# EAGLE schematic 3D_PRINTER_SHILED_V1 (EAGLE 6.5.0)
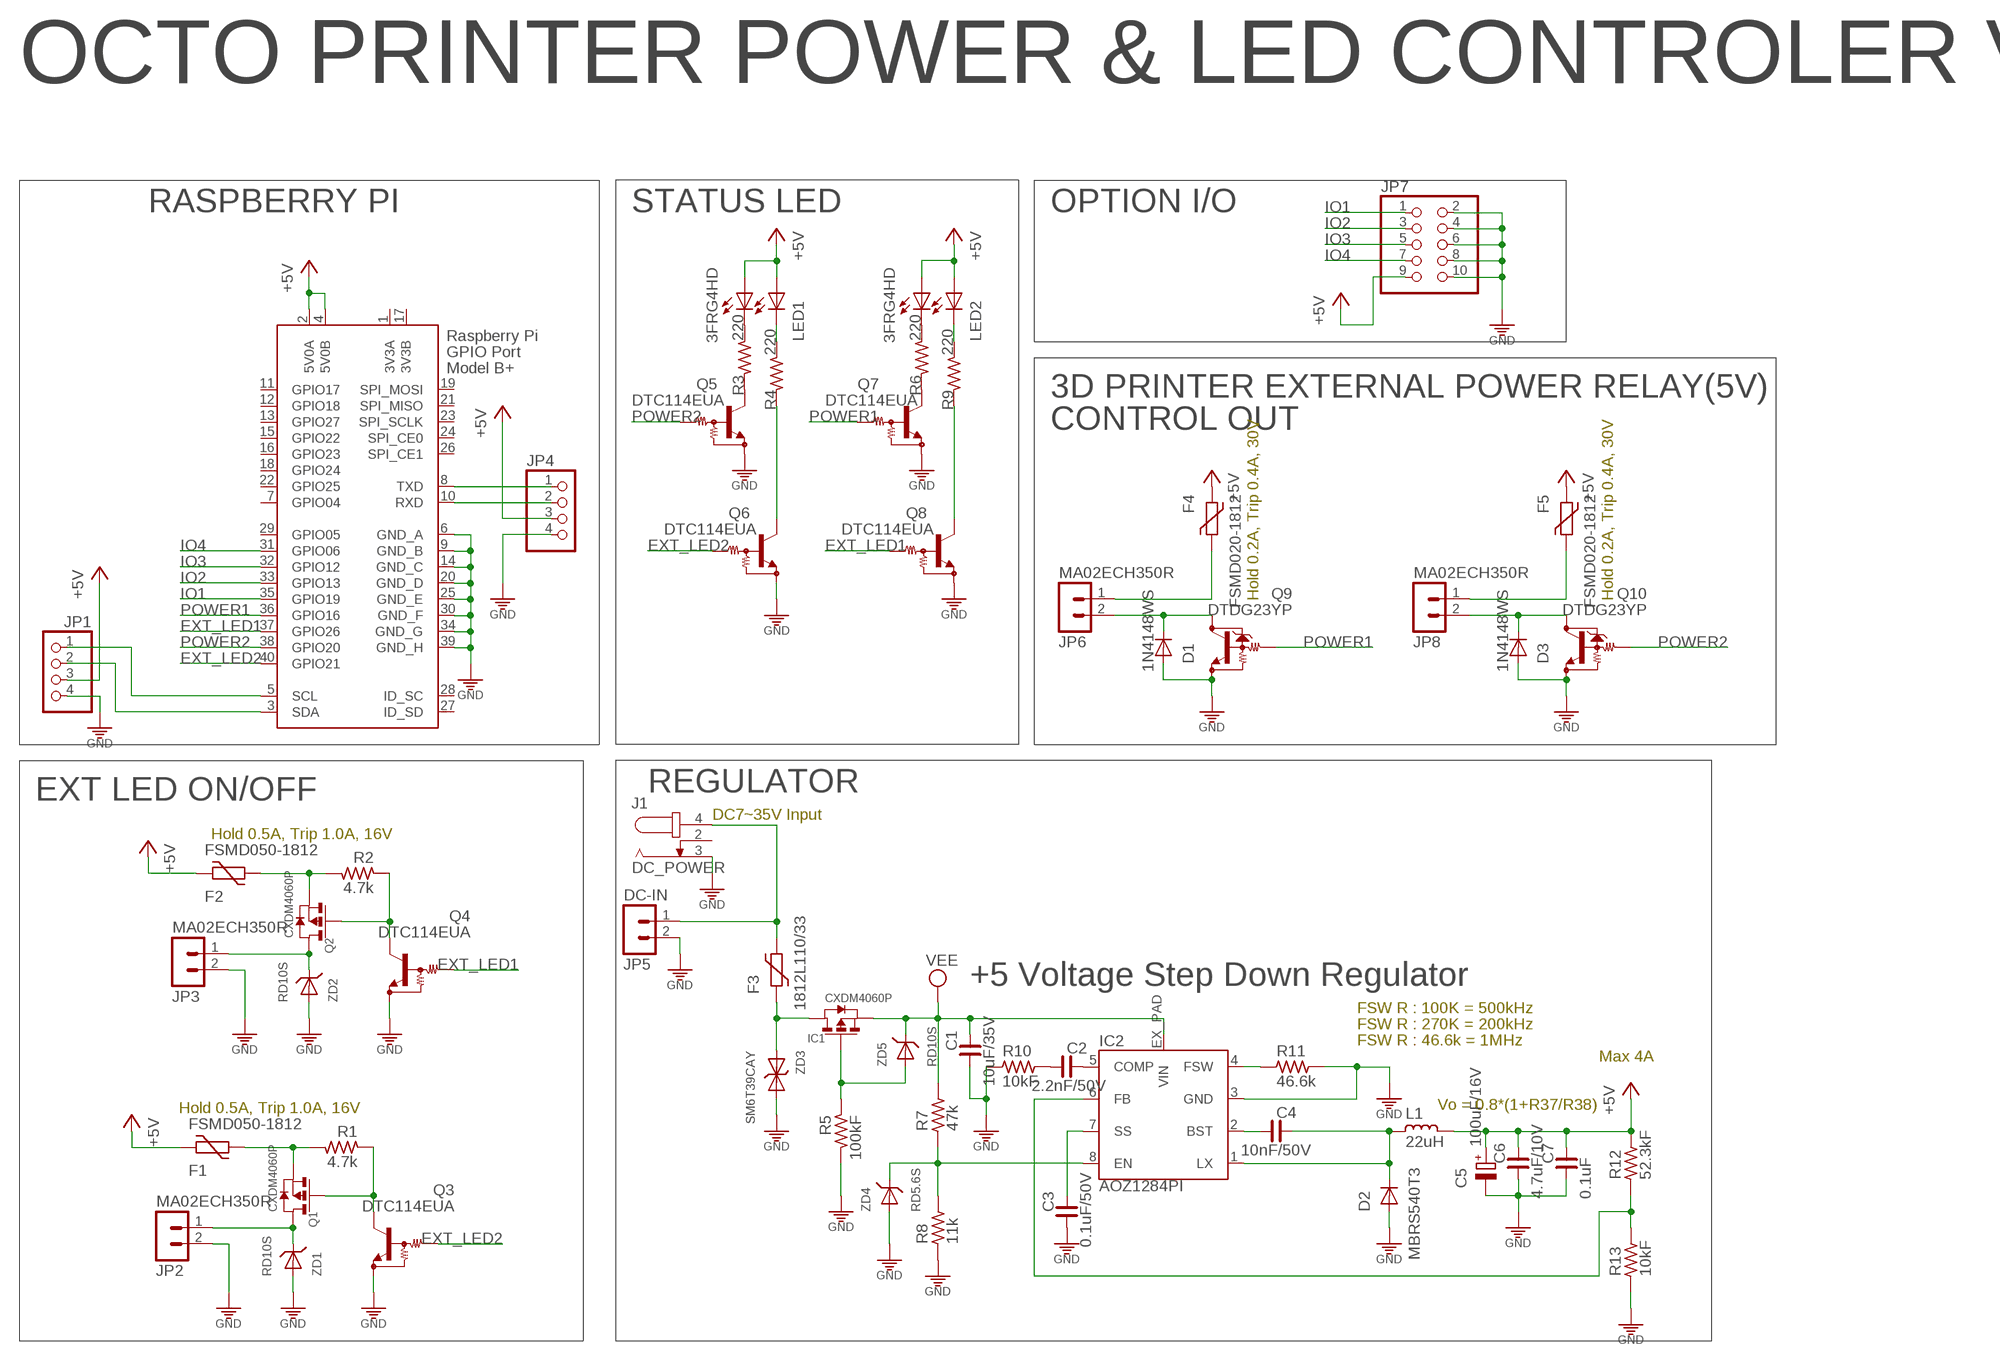
[diagram p0: schematic, sheet 1]

## Parts
C1  10uF/35V  C_3225  [C3225]
C2  2.2nF/50V  C_0603  [C0603]
C3  0.1uF/50V  C_0603  [C0603]
C4  10nF/50V  C_0603  [C0603]
C5  100uF/16V  CPOL-EUD/7343-31W  [D/7343-31W]
C6  4.7uF/10V  C_2012  [C2012]
C7  0.1uF  C_0603  [C0603]
D1  1N4148WS  B5189WN  [SOD323]
D2  MBRS540T3  DIODE-SMC  [SMC]
D3  1N4148WS  B5189WN  [SOD323]
F1  FSMD050-1812  1812L  [1812L]
F2  FSMD050-1812  1812L  [1812L]
F3  1812L110/33  1812L  [1812L]
F4  FSMD020-1812  1812L  [1812L]
F5  FSMD020-1812  1812L  [1812L]
IC1  CXDM4060P  CXDM4060PCXDM4060P  [SOT89]
IC2  AOZ1284PI  [S08-EP1]
J1  DC_POWER  DC-JACK005A  [DC-005]
JP1  PINHD-1X4  [1X04]
JP2  MA02ECH350R  [ECH350R-02]
JP3  MA02ECH350R  [ECH350R-02]
JP4  PINHD-1X4  [1X04]
JP5  DC-IN  MA02ECH350R  [ECH350R-02]
JP6  MA02ECH350R  [ECH350R-02]
JP7  PINHD-2X5/90  [2X05/90]
JP8  MA02ECH350R  [ECH350R-02]
L1  22uH  L_SHP1260P-F  [SHP1260P-F]
LED1  3FRG4HD  [3FRG4H]
LED2  3FRG4HD  [3FRG4H]
Q1  CXDM4060P  CXDM4060PCXDM4060P  [SOT89]
Q2  CXDM4060P  CXDM4060PCXDM4060P  [SOT89]
Q3  DTC114EUA  [SC59-BEC]
Q4  DTC114EUA  [SC59-BEC]
Q5  DTC114EUA  [SC59-BEC]
Q6  DTC114EUA  [SC59-BEC]
Q7  DTC114EUA  [SC59-BEC]
Q8  DTC114EUA  [SC59-BEC]
Q9  DTDG23YP  [MPT3]
Q10  DTDG23YP  [MPT3]
R1  4.7k  R_0603  [R0603]
R2  4.7k  R_0603  [R0603]
R3  220  R_0603  [R0603]
R4  220  R_0603  [R0603]
R5  100kF  R_0603  [R0603]
R6  220  R_0603  [R0603]
R7  47k  R_0603  [R0603]
R8  11k  R_0603  [R0603]
R9  220  R_0603  [R0603]
R10  10kF  R_0603  [R0603]
R11  46.6k  R_0603  [R0603]
R12  52.3kF  R_0603  [R0603]
R13  10kF  R_0603  [R0603]
X1  RASPI_BOARD_B+#_F  [RASPI_BOARD_B+_FULL]
ZD1  RD10S  ZENER_DIODERD47S  [DSMM]
ZD2  RD10S  ZENER_DIODERD47S  [DSMM]
ZD3  SM6T39CAY  ZDSM6T33CAY  [SMB]
ZD4  RD5.6S  ZENER_DIODERD47S  [DSMM]
ZD5  RD10S  ZENER_DIODERD47S  [DSMM]

## Nets
+5V: C5.+ C6.1 C7.1 F1.P$1 F2.P$1 F4.P$1 F5.P$1 JP1.3 JP4.3 JP7.9 L1.1 LED1.A1(A2) LED1.A(A1) LED2.A1(A2) LED2.A(A1) R12.2 X1.2(5V0A) X1.4(5V0B)
DC-IN: F3.P$1 IC1.2(D) IC1.2@1(D) ZD3.A
EXT_LED1: Q4.2(IN) Q8.2(IN) X1.37(GPIO26)
EXT_LED2: Q3.2(IN) Q6.2(IN) X1.40(GPIO21)
GND [GND]: C1.2 C3.2 C5.- C6.2 C7.2 D1.A D2.A D3.A IC2.3(GND) J1.3 JP1.4 JP2.2 JP3.2 JP4.4 JP5.2 JP7.2 JP7.4 JP7.6 JP7.8 JP7.10 Q3.1(GND) Q4.1(GND) Q5.1(GND) Q6.1(GND) Q7.1(GND) Q8.1(GND) Q9.EMITTER(GND) Q10.EMITTER(GND) R5.2 R8.1 R10.1 R11.2 R13.1 X1.6(GND_A) X1.9(GND_B) X1.14(GND_C) X1.20(GND_D) X1.25(GND_E) X1.30(GND_F) X1.34(GND_G) X1.39(GND_H) ZD1.A ZD2.A ZD3.C(K) ZD4.A
IO1: JP7.1 X1.35(GPIO19)
IO2: JP7.3 X1.33(GPIO13)
IO3: JP7.5 X1.32(GPIO12)
IO4: JP7.7 X1.31(GPIO06)
N$1: D1.C JP6.2 Q9.COLLECTOR(OUT)
N$2: Q1.3(G) Q3.3(OUT) R1.1
N$3: JP2.1 Q1.2(D) Q1.2@1(D) ZD1.C
N$4: F2.P$2 Q2.1(S) R2.2
N$7: F1.P$2 Q1.1(S) R1.2
N$8: D3.C JP8.2 Q10.COLLECTOR(OUT)
N$9: F5.P$2 JP8.1
N$11: F4.P$2 JP6.1
N$12: IC2.6(FB) R12.1 R13.2
N$13: JP1.1 X1.5(SCL)
N$14: C4.2 IC2.2(BST)
N$15: JP3.1 Q2.2(D) Q2.2@1(D) ZD2.C
N$16: JP1.2 X1.3(SDA)
N$17: JP4.1 X1.8(TXD)
N$18: JP4.2 X1.10(RXD)
N$27: C4.1 D2.C IC2.1(LX) L1.2
N$28: IC2.4(FSW) R11.1
N$29: C3.1 IC2.7(SS)
N$30: IC2.8(EN) R7.1 R8.2 ZD4.C
N$31: C2.1 IC2.5(COMP)
N$32: Q2.3(G) Q4.3(OUT) R2.1
N$34: C2.2 R10.2
N$60: Q5.3(OUT) R3.2
N$61: LED1.K(C1) R3.1
N$62: LED1.K1(C2) R4.1
N$77: Q7.3(OUT) R6.2
N$78: LED2.K(C1) R6.1
N$79: LED2.K1(C2) R9.1
N$80: Q8.3(OUT) R9.2
N$85: Q6.3(OUT) R4.2
N$98: IC1.3(G) R5.1 ZD5.A
N$99: F3.P$2 J1.4 JP5.1
POWER1: Q7.2(IN) Q9.BASE(IN) X1.36(GPIO16)
POWER2: Q5.2(IN) Q10.BASE(IN) X1.38(GPIO20)
VEE: C1.1 IC1.1(S) IC2.EX_PAD(VIN) R7.2 ZD5.C
Unconnected: J1.2 X1.7(GPIO04) X1.11(GPIO17) X1.12(GPIO18) X1.13(GPIO27) X1.15(GPIO22) X1.16(GPIO23) X1.18(GPIO24) X1.19(SPI_MOSI) X1.21(SPI_MISO) X1.22(GPIO25) X1.23(SPI_SCLK) X1.24(SPI_CE0) X1.26(SPI_CE1) X1.27(ID_SD) X1.28(ID_SC) X1.29(GPIO05)

## Notes on the sheet
- OCTO PRINTER POWER & LED CONTROLER V1.0
- RASPBERRY PI | STATUS LED | OPTION I/O
- 3D PRINTER EXTERNAL POWER RELAY(5V)
- CONTROL OUT
- Hold 0.2A, Trip 0.4A, 30V | Hold 0.2A, Trip 0.4A, 30V
- EXT LED ON/OFF
- REGULATOR
- DC7~35V Input
- Hold 0.5A, Trip 1.0A, 16V
- +5 Voltage Step Down Regulator
- FSW R : 100K = 500kHz
- FSW R : 270K = 200kHz
- FSW R : 46.6k = 1MHz
- Max 4A
- Vo = 0.8*(1+R37/R38)
- Hold 0.5A, Trip 1.0A, 16V

## Power pins joined to a net without a drawn wire
3V3A: X1.1(3V3A)
3V3B: X1.17(3V3B)

## Library data of the parts
C1-C4 C6 C7 = cona_lib:C_: NON-POLARIZED CAP
C5 = cona_lib:CPOL-EU: POLARIZED CAPACITOR, European symbol
D1 D3 = cona_lib:B5189W
D2 = diode:DIODE-: DIODE
F1-F5 = ptc-littlefuse:1812L
IC1 Q1 Q2 = cona_lib:CXDM4060P
IC2 = cona_lib:AOZ1284PI
J1 = cona_lib:DC-JACK
JP1 JP4 = pinhead_254:PINHD-1X4: PIN HEADER
JP2 JP3 JP5 JP6 JP8 = cona_lib:MA02
JP7 = pinhead_254:PINHD-2X5: PIN HEADER
L1 = cona_lib:L_: INDUCTOR
LED1 LED2 = cona_lib:3FRG4HD
Q3-Q8 = cona_lib:DTC114EUA: NPN Bias Resistor Transistor
Q9 Q10 = cona_lib:DTDG23YP
R1-R13 = cona_lib:R_: RESISTOR
X1 = raspberrypi_bastelstube_v13:RASPI_BOARD_B+#: Raspberry Pi GPIO connector with markings for the outer dimensions of the Raspberry Pi board model B+ with different sets of drill holes or mounting pads All pins connected
ZD1 ZD2 ZD4 ZD5 = GRU-EURO6:ZENER_DIODE
ZD3 = GRU-EURO6:ZD

## Net classes
0 default: clearance 0.152 mm
1 power: width 0.152 mm
2 GND: width 0.152 mm, clearance 0.152 mm